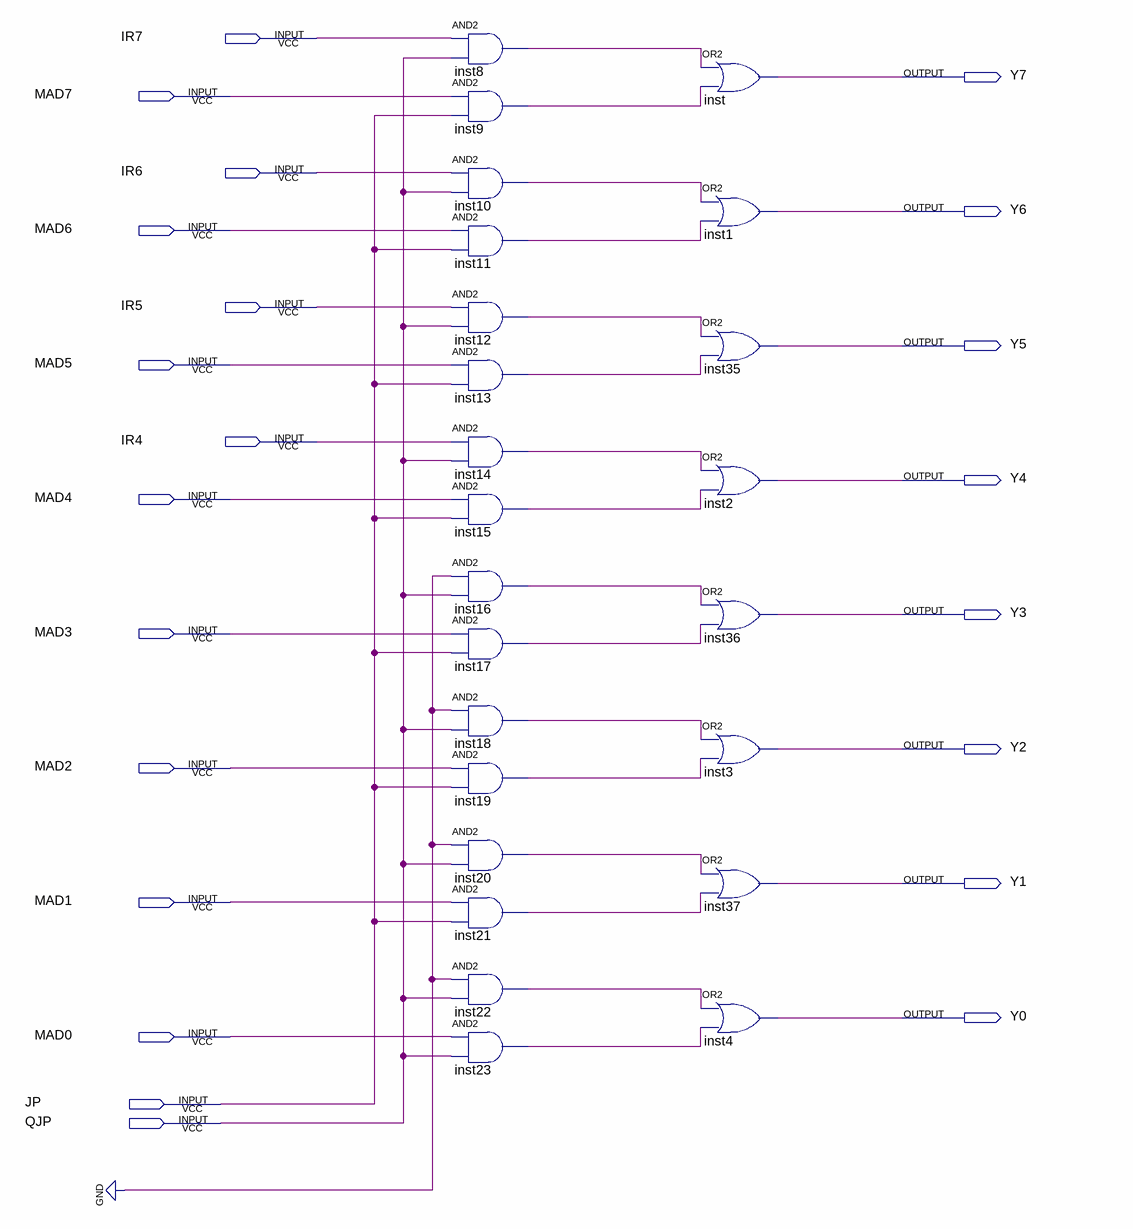
[diagram p0: schematic sheet]
// Quartus schematic houjiweidizhi.bdf as structural Verilog: 24 symbols, 22 pins
module houjiweidizhi (
  input  IR7,
  input  MAD7,
  input  IR6,
  input  MAD6,
  input  IR5,
  input  MAD5,
  input  IR4,
  input  MAD4,
  input  MAD3,
  input  MAD2,
  input  MAD1,
  input  MAD0,
  input  JP,
  input  QJP,
  output Y7,
  output Y6,
  output Y5,
  output Y4,
  output Y3,
  output Y2,
  output Y1,
  output Y0
);

  wire inst8_out, inst9_out, inst10_out, inst11_out, inst12_out, inst13_out, inst14_out, inst15_out,
       inst16_out, inst17_out, inst18_out, inst19_out, inst20_out, inst21_out, inst22_out, inst23_out;

  and inst8 (inst8_out, IR7, QJP);
  and inst9 (inst9_out, MAD7, JP);
  and inst10 (inst10_out, IR6, QJP);
  and inst11 (inst11_out, MAD6, JP);
  and inst12 (inst12_out, IR5, QJP);
  and inst13 (inst13_out, MAD5, JP);
  and inst14 (inst14_out, IR4, QJP);
  and inst15 (inst15_out, MAD4, JP);
  and inst16 (inst16_out, 1'b0, QJP);
  and inst17 (inst17_out, MAD3, JP);
  and inst18 (inst18_out, 1'b0, QJP);
  and inst19 (inst19_out, MAD2, JP);
  and inst20 (inst20_out, 1'b0, QJP);
  and inst21 (inst21_out, MAD1, JP);
  and inst22 (inst22_out, 1'b0, QJP);
  and inst23 (inst23_out, MAD0, QJP);
  or inst (Y7, inst8_out, inst9_out);
  or inst1 (Y6, inst10_out, inst11_out);
  or inst35 (Y5, inst12_out, inst13_out);
  or inst2 (Y4, inst14_out, inst15_out);
  or inst36 (Y3, inst16_out, inst17_out);
  or inst3 (Y2, inst18_out, inst19_out);
  or inst37 (Y1, inst20_out, inst21_out);
  or inst4 (Y0, inst22_out, inst23_out);
endmodule
